# Altium schematic sheet Buzzer.SchDoc: Speaker Driver
size A3; DrawnBy: Harry Dobbs; Address1: ECE Department; Address2: University of Canterbury; Address3: Christchurch 8041; Address4: New Zealand; Revision: 1
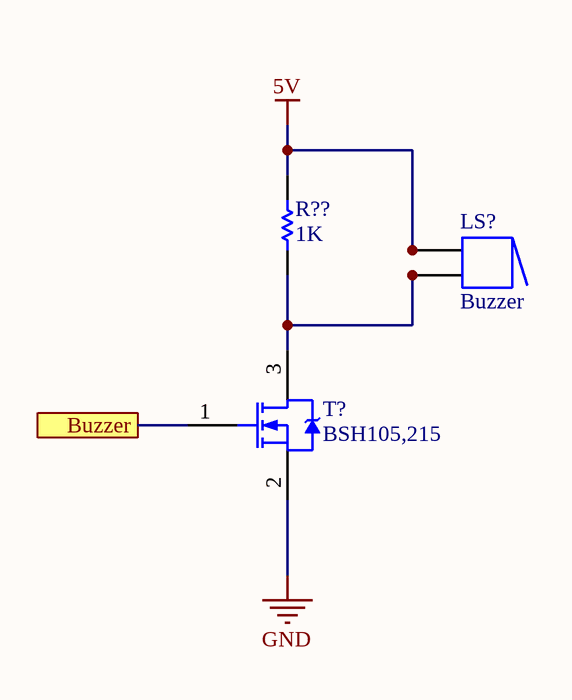
[diagram p0: Buzzer.SchDoc]

## Parts
LS?  Buzzer  [ABSM-1574]
R??  1K  [RESC1608L]
T?  BSH105,215  [SOT23_L]

## Ports
Buzzer

## Nets
5V: LS?.1 LS?.1A R??.2
GND: T?.2
Buzzer: T?.1 ; port Buzzer
NetLS?_2: LS?.2 LS?.2A R??.1 T?.3

## Notes on the sheet
- Title
- Drawn by:
- Date:
- Time:
- Revision:
- Sheet
- of
- File:

## Library data of the parts
LS? = Buzzer: Magnetic Transducer Buzzer; Published: 24-Mar-1999; LatestRevisionDate: 17-Dec-2003; LatestRevisionNote: Schematic revised, PCB Footprint replaced.; DatasheetVersion: 17-Dec-2003; PackageReference: ABSM-1574; Publisher: Altium Limited; PackageDescription: Magnetic Transducer Buzzer; ComponentLink1Description: Manufacturer Link; ComponentLink1URL: http://www.megastar.com/linecard/buzzmode/index.php
R?? = RS_1K: RES 1.0K OHM 1/10W 5% 0603 SMD; Storage Location: PCB Assembly WS; Supplier: ECE Dept; Value: 1K
T? = TM_BSH105: MOSFET N-CH 20V 1.05A SOT-23; Manufacturer: NXP Semiconductors; FET Type: MOSFET N-Channel, Metal Oxide; Gate Charge (Qg) @ Vgs: 3.9nC @ 4.5V; Input Capacitance (Ciss) @ Vds: 152pF @ 16V; Power - Max: 417mW; Rds On (Max) @ Id, Vgs: 200 mOhm @ 600mA, 4.5V; Supplier 1: Farnell; Supplier 2: Digi-Key; Current - Continuous Drain (Id) @ 25° C: 1.05A; Drain to Source Voltage (Vdss): 20V; Package / Case: TO-236-3, SC-59, SOT-23-3; Pricing: 1=0.53, 10=0.42, 25=0.3544, 100=0.2885, 250=0.23896, 500=0.1974, 1000=0.14785 (NZD); Supplier Part Number 1: 1758066; Supplier Part Number 2: 568-6215-1-ND; Storage Location: PCB Assembly WS; Supplier: ECE Dept; Manufacturer Part Number: BSH105,215